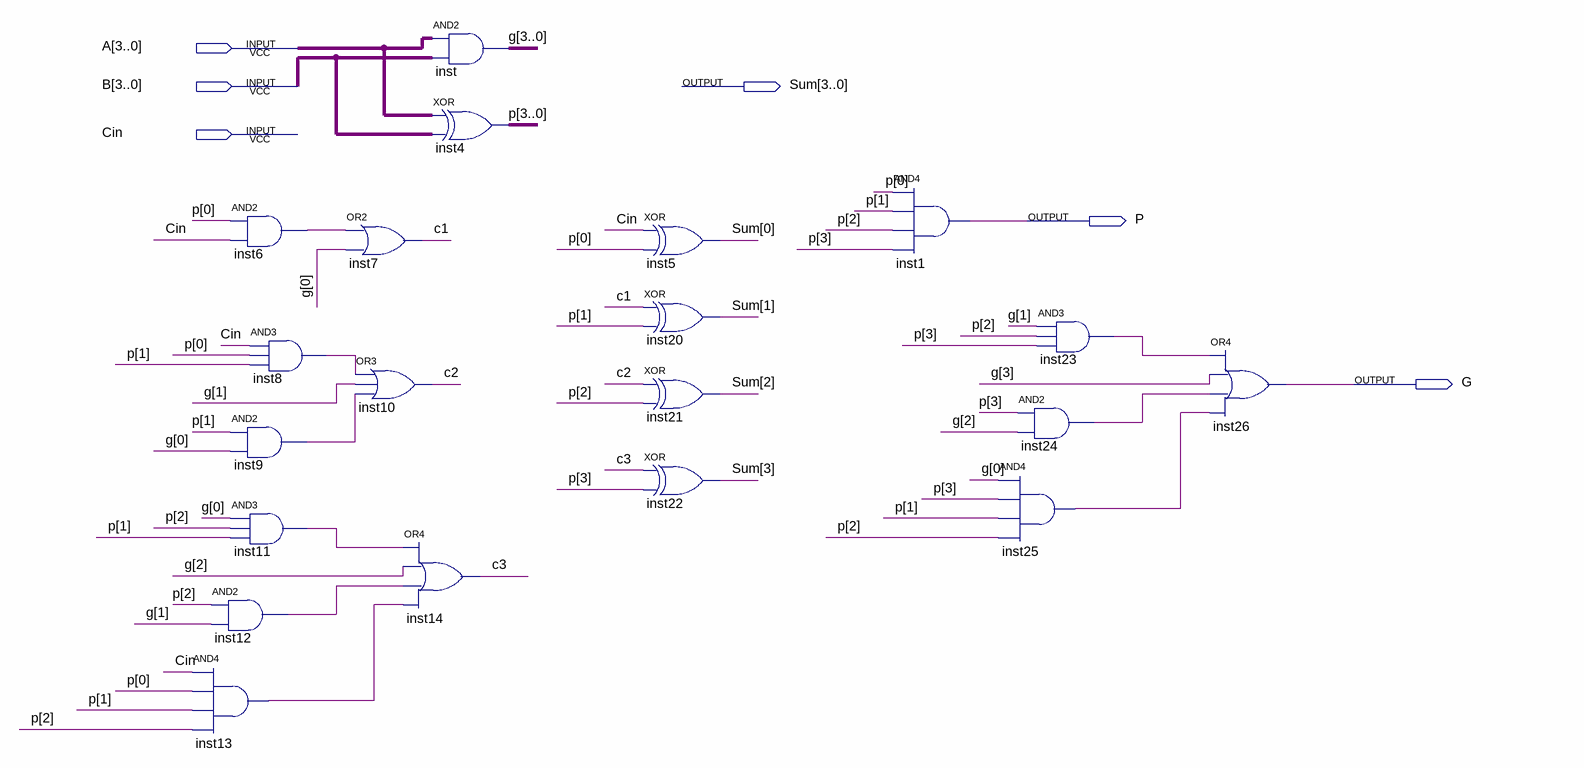
[diagram p0: schematic sheet]
// Quartus schematic ClaFourBitAdderPGOut.bdf as structural Verilog: 20 symbols, 6 pins
module ClaFourBitAdderPGOut (
  input  [3:0] A,
  input  [3:0] B,
  input  Cin,
  output [3:0] Sum,
  output P,
  output G
);

  wire c1, c2, c3, inst6_out, inst8_out, inst9_out, inst11_out, inst12_out, inst13_out, inst23_out,
       inst24_out, inst25_out;
  wire [3:0] G_bus, P_bus;

  and inst13 (inst13_out, Cin, P_bus[0], P_bus[1], P_bus[2]);
  and inst6 (inst6_out, P_bus[0], Cin);
  and inst8 (inst8_out, Cin, P_bus[0], P_bus[1]);
  and inst9 (inst9_out, P_bus[1], G_bus[0]);
  and inst11 (inst11_out, G_bus[0], P_bus[2], P_bus[1]);
  and inst12 (inst12_out, P_bus[2], G_bus[1]);
  or inst7 (c1, inst6_out, G_bus[0]);
  or inst10 (c2, inst8_out, G_bus[1], inst9_out);
  assign G_bus = A & B;  // AND2 inst, 4 bits wide
  assign P_bus = A ^ B;  // XOR inst4, 4 bits wide
  or inst14 (c3, inst11_out, G_bus[2], inst12_out, inst13_out);
  xor inst5 (Sum[0], Cin, P_bus[0]);
  xor inst20 (Sum[1], c1, P_bus[1]);
  xor inst21 (Sum[2], c2, P_bus[2]);
  xor inst22 (Sum[3], c3, P_bus[3]);
  and inst1 (P, P_bus[0], P_bus[1], P_bus[2], P_bus[3]);
  and inst23 (inst23_out, G_bus[1], P_bus[2], P_bus[3]);
  and inst24 (inst24_out, P_bus[3], G_bus[2]);
  and inst25 (inst25_out, G_bus[0], P_bus[3], P_bus[1], P_bus[2]);
  or inst26 (G, inst23_out, G_bus[3], inst24_out, inst25_out);
endmodule
